# Altium schematic sheet 2312_Alimentation.SchDoc
size A4; Organization: ETML-ES; Address1: Avenue Recordon 1; Address2: 1004 Lausanne; Address3: Switzerland; SheetNumber: 1; SheetTotal: 1
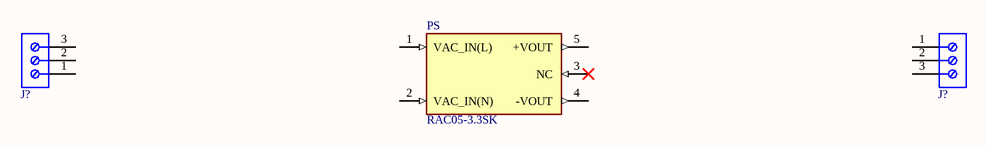
[diagram p0: 2312_Alimentation.SchDoc]

## Parts
(Parts that share a designator on the sheet are numbered #1, #2 ... from top to bottom, then left to right.)
J?#1  691137710003  [691137710003]  (value not drawn)
J?#2  691137710003  [691137710003]  (value not drawn)
PS  RAC05-3.3SK  [CONV_RAC05-3.3SK]

## Nets

Not connected (* = marked no-connect by the designer): J?#1 1 2 3; J?#2 1 2 3; PS 1(VAC_IN(L)) 2(VAC_IN(N)) 3(NC)* 4(-VOUT) 5(+VOUT)

## Notes on the sheet
- Fichier :
- a
- Date :
- Heure :
- Version :
- Auteur :
- Modif.
- b
- c
- d
- Projet :
- No :
- Nb feuilles
- Feuille n°
- Chemin :

## Library data of the parts
J?#1 J?#2 = 691137710003: WR-TBL Series 1377 Horizontal Entry, THT, pitch 5mm, 3p; Manufacturer: Wurth Elektronik; Modularity: No; Rated Current: 16A; Working Voltage: 300V; ComponentLink1Description: Website Link; ComponentLink1URL: https://www.we-online.com/redexpert/article/691137710003?ad; ComponentLink2Description: Datasheet Link; ComponentLink2URL: https://www.we-online.com/redexpert/spec/691137710003?ad; Manufacturer Part Number: 691137710003; Category: Terminal Blocks; Match Code: WR-TBL; Mount: Through Hole; Operating Temperature Max: 120°C; Operating Temperature Min: -30°C; Packaging: Box; Application: Pressure Clamp; Number of Pins: 3; Number of Rows: 1; Orientation: Horizontal; Pitch: 5mm
PS = RAC05-3.3SK: 5W AC/DC-Converter 'POWERLINE' 1x1 4kV reg; MF: Recom Power; Value: *; Package: DIP-5 Recom Power; MP: RAC05-3.3SK; Price: None; SnapEDA_Link: https://www.snapeda.com/parts/RAC05-3.3SK/Recom%20Power/view-part/2834355/?ref=snap; Availability: Unavailable